# EAGLE schematic board (EAGLE 7.1.0)
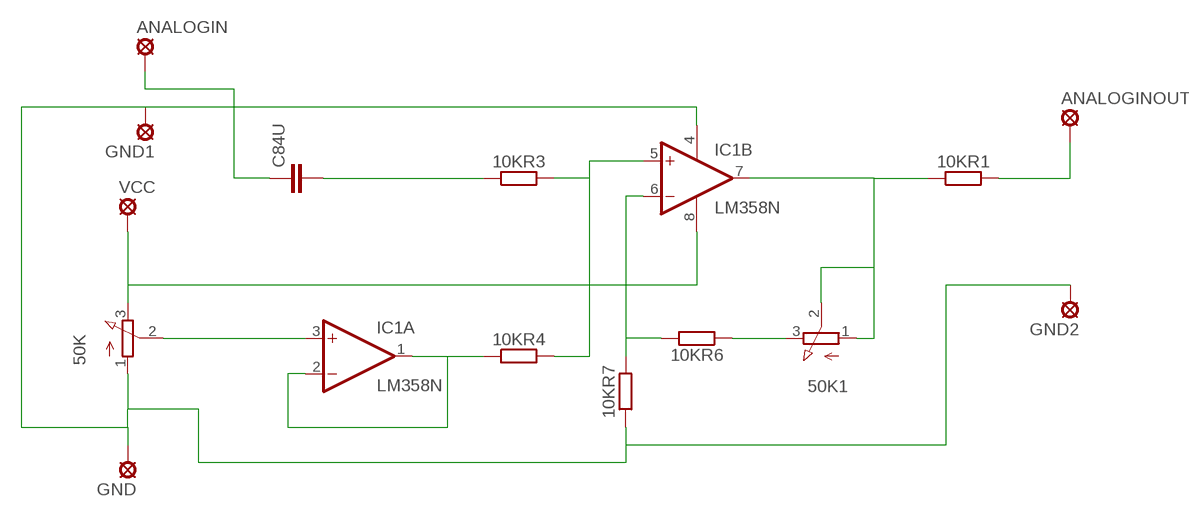
[diagram p0: schematic, sheet 1]

## Parts
10KR1  R-EU_0411/12  [0411/12]
10KR3  R-EU_0411/12  [0411/12]
10KR4  R-EU_0411/12  [0411/12]
10KR6  R-EU_0411/12  [0411/12]
10KR7  R-EU_0411/12  [0411/12]
50K  3RP/1610N  [3RP/1610N]
50K1  3RP/1610N  [3RP/1610N]
ANALOGIN  SE11  [SE11]
ANALOGINOUT  SE11  [SE11]
C84U  C2.5/6  [C2.5-6]
GND  SE11  [SE11]
GND1  SE11  [SE11]
GND2  SE11  [SE11]
IC1  LM358N  [DIL08]
VCC  SE11  [SE11]

## Nets
100KR1: 10KR1.1 50K1.1(A) 50K1.2(S) IC1.7(B:OUT)
GND: 10KR7.1 50K.1(A) GND1.MP GND2.MP GND.MP IC1.4(P:V-)
N$3: 50K.2(S) IC1.3(A:+IN)
N$4: 10KR4.1 IC1.1(A:OUT) IC1.2(A:-IN)
N$5: 10KR3.2 10KR4.2 IC1.5(B:+IN)
N$6: 10KR3.1 C84U.2
N$7: ANALOGIN.MP C84U.1
N$8: 10KR6.2 10KR7.2 IC1.6(B:-IN)
N$9: 10KR6.1 50K1.3(E)
N$11: 10KR1.2 ANALOGINOUT.MP
VCC: 50K.3(E) IC1.8(P:V+) VCC.MP

## Library data of the parts
10KR1 10KR3 10KR4 10KR6 10KR7 = rcl:R-EU_: RESISTOR, European symbol
50K 50K1 = pot:3RP/1610N: 16mm Potentiometer one level Source: http://www.alphapotentiometers.net/html/16mm_pot_2.html
ANALOGIN ANALOGINOUT GND GND1 GND2 VCC = solpad:SE11: SOLDER PAD RTM, drill 1,1mm, distributor Buerklin, 07F810
C84U = capacitor-wima:C: CAPACITOR naming: grid - package width
IC1 = linear:LM358: OP AMP also LM158; LM258; LM2904 Source: http://cache.national.com/ds/LM/LM158.pdf